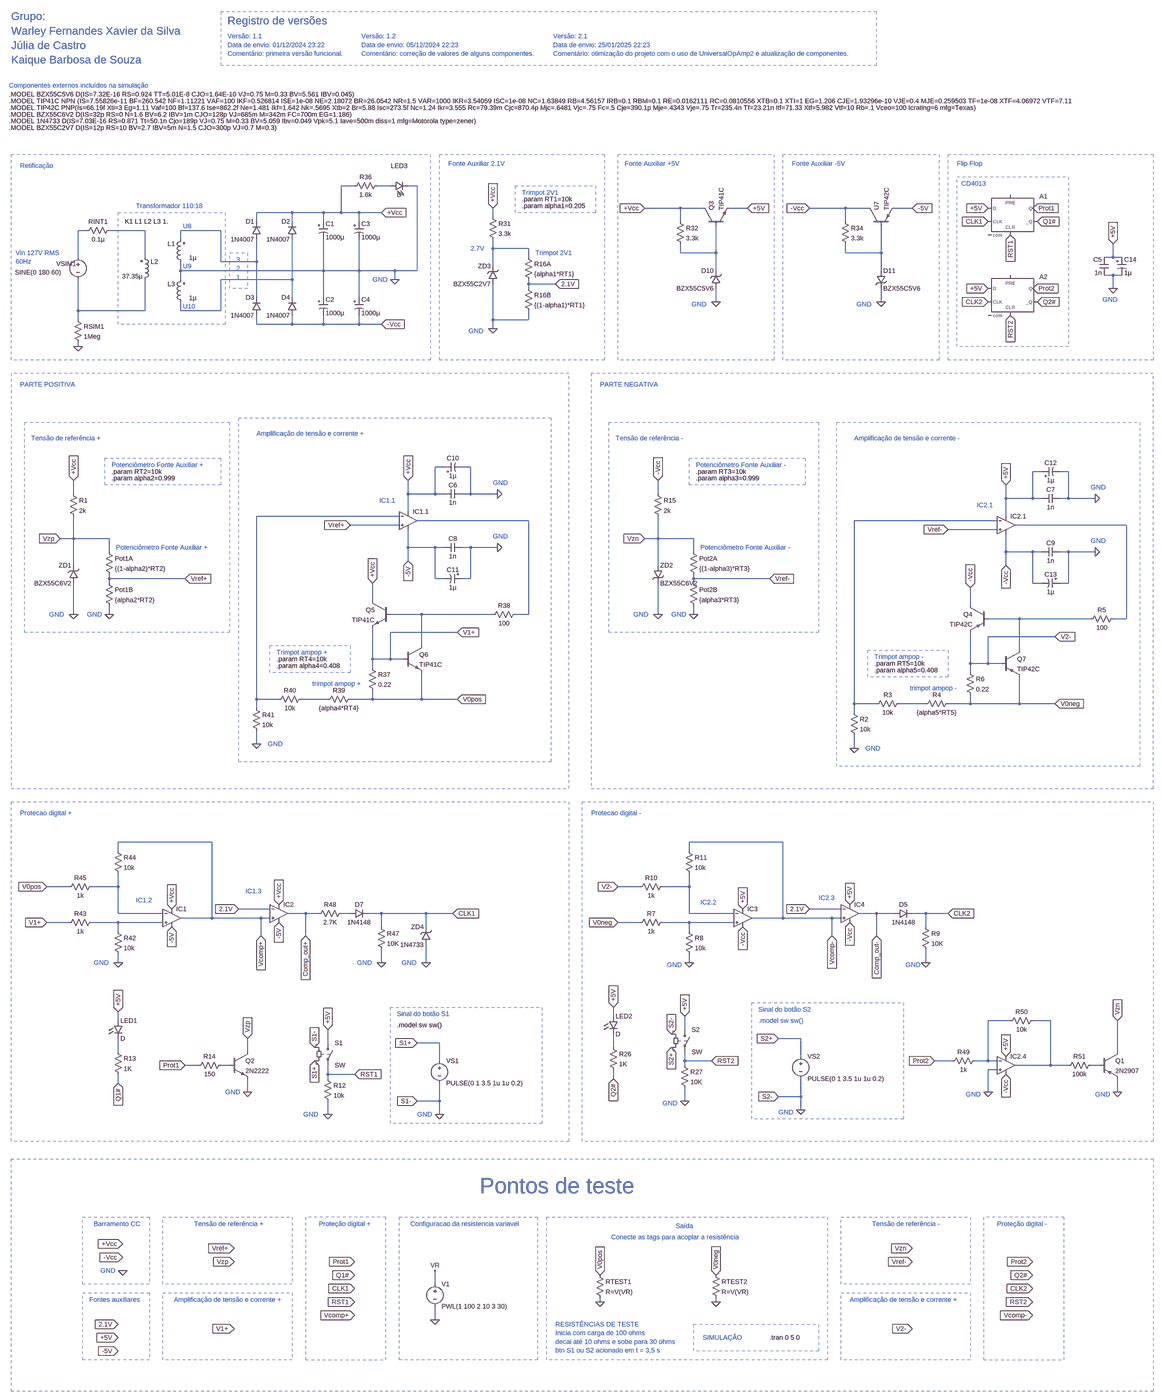
[diagram p0: schematic LinearVoltageSupply.asc, whole sheet]
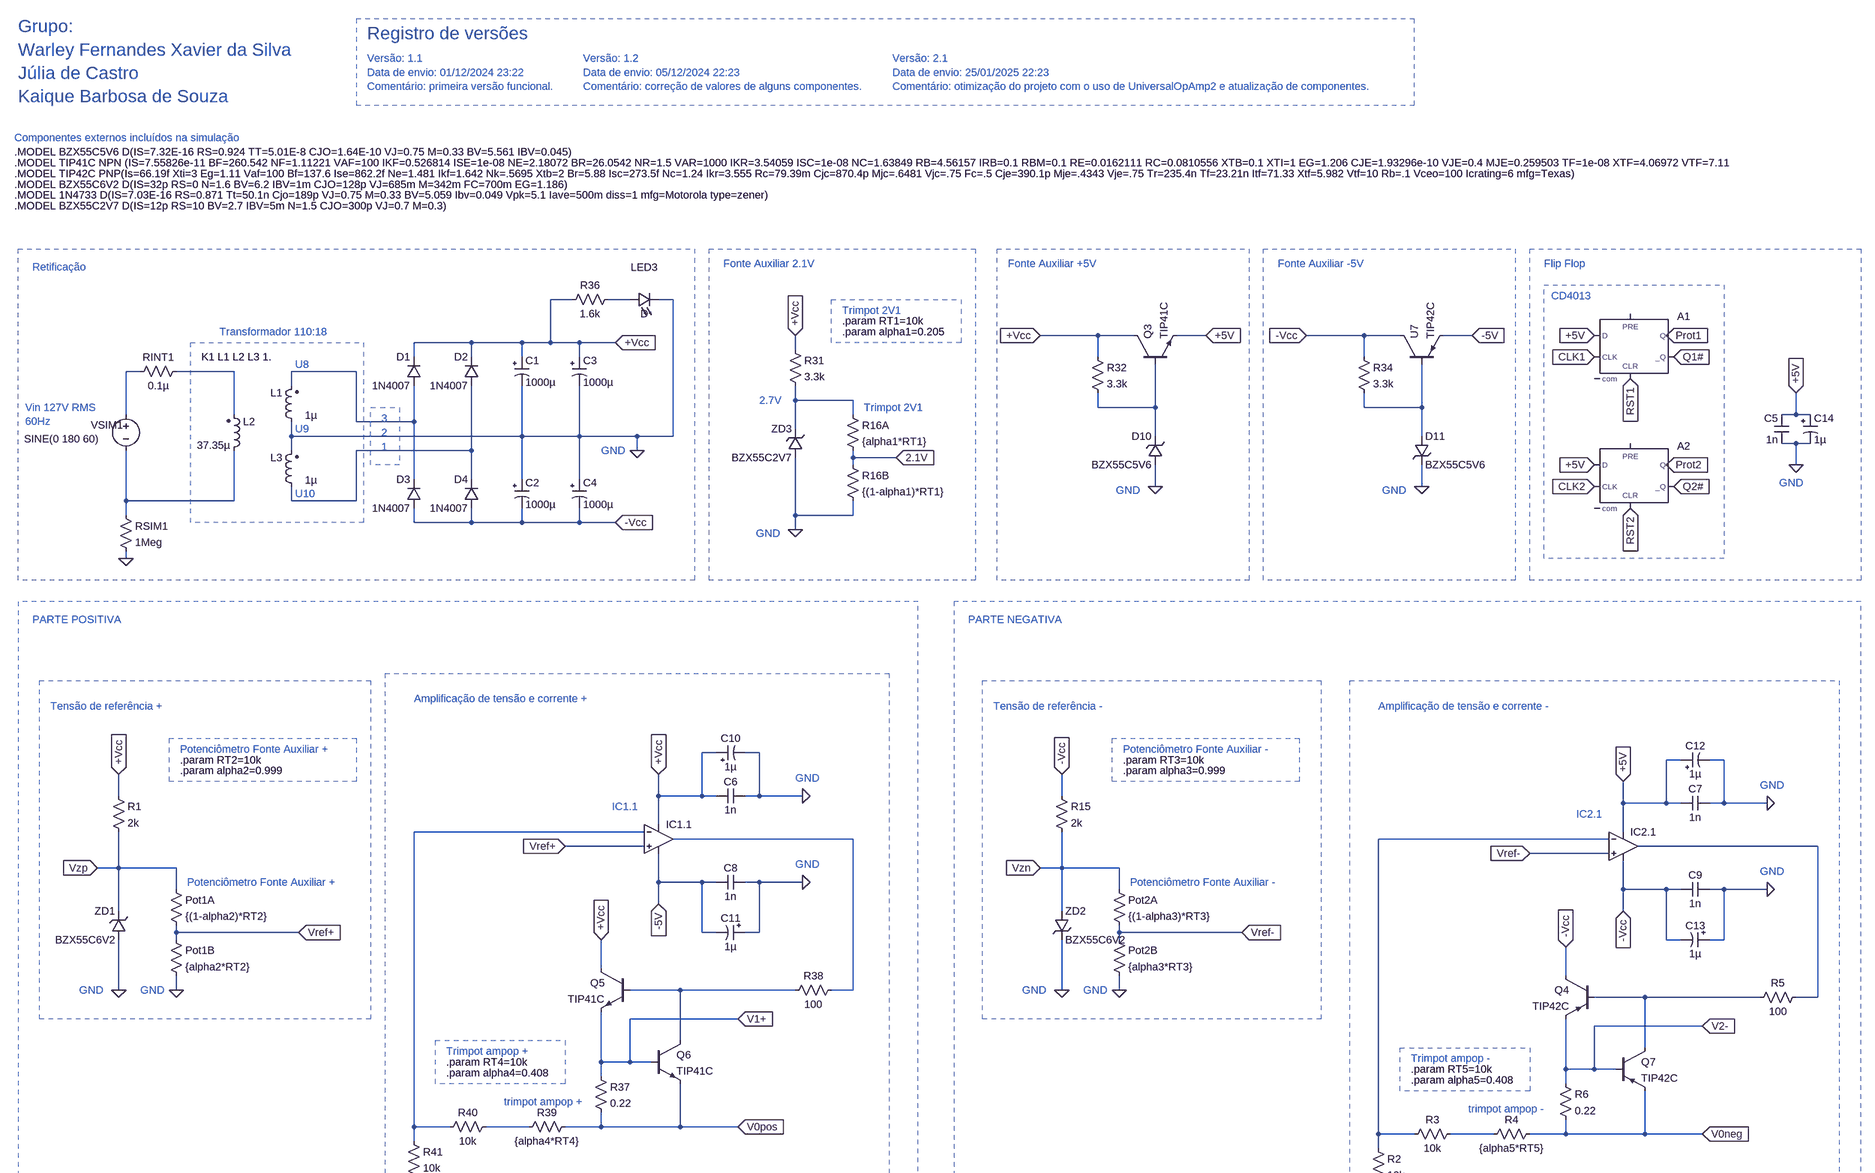
[diagram p1: schematic LinearVoltageSupply.asc, part, row 1 of 2, column 1 of 1]
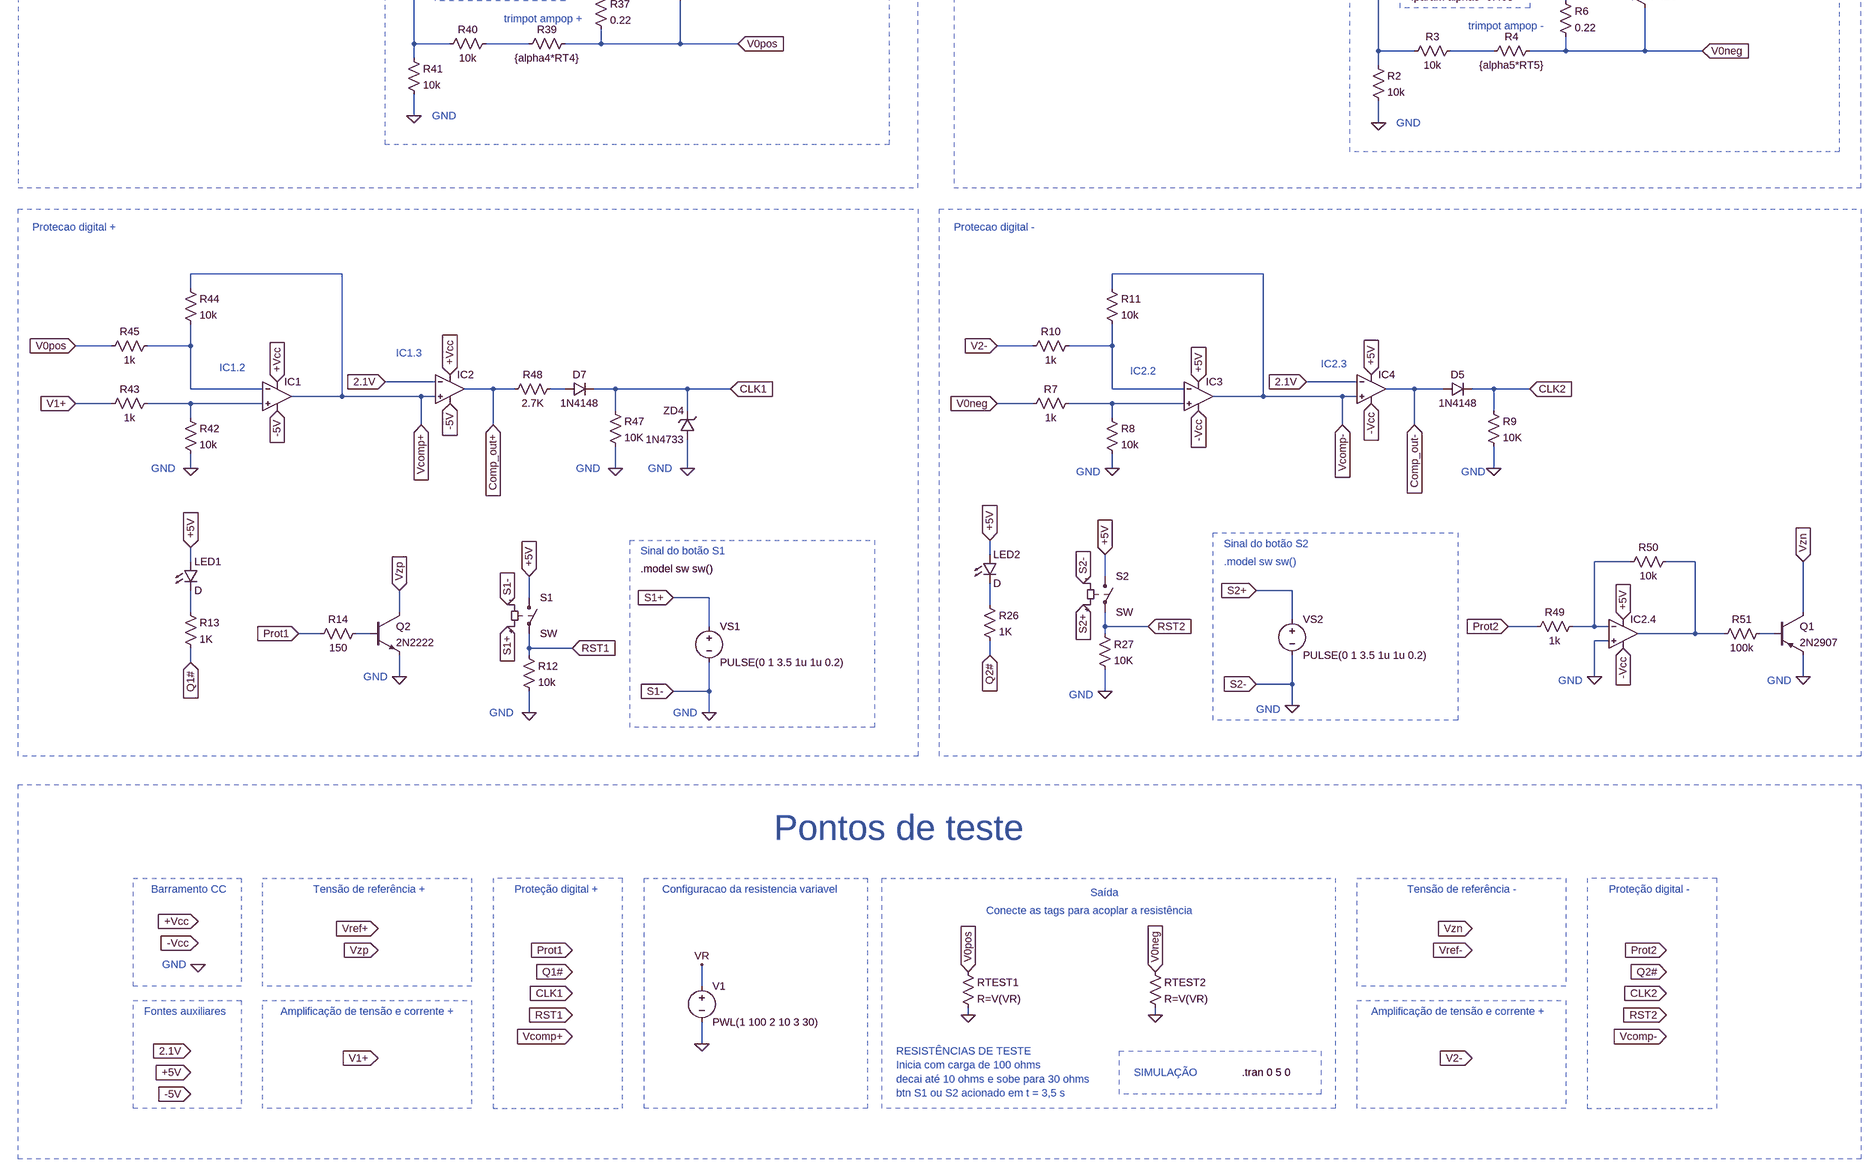
[diagram p2: schematic LinearVoltageSupply.asc, part, row 2 of 2, column 1 of 1]
LinearVoltageSupply.asc, the LTspice schematic file:
Version 4.1
SHEET 1 7264 6356
WIRE 1168 128 1120 128
WIRE 1296 128 1248 128
WIRE 1392 128 1360 128
WIRE 2336 208 2208 208
WIRE 2416 208 2336 208
WIRE 2576 208 2512 208
WIRE 2928 208 2800 208
WIRE 3008 208 2928 208
WIRE 3168 208 3104 208
WIRE 944 224 816 224
WIRE 1056 224 944 224
WIRE 1120 224 1120 128
WIRE 1120 224 1056 224
WIRE 1184 224 1120 224
WIRE 1264 224 1184 224
WIRE 1664 240 1664 208
WIRE 816 256 816 224
WIRE 944 256 944 224
WIRE 1056 256 1056 224
WIRE 1184 256 1184 224
WIRE 2336 256 2336 208
WIRE 2928 256 2928 208
WIRE 208 288 176 288
WIRE 416 288 288 288
WIRE 688 288 544 288
WIRE 544 320 544 288
WIRE 1664 352 1664 320
WIRE 1792 352 1664 352
WIRE 2336 368 2336 336
WIRE 2464 368 2464 272
WIRE 2464 368 2336 368
WIRE 2928 368 2928 336
WIRE 3056 368 3056 272
WIRE 3056 368 2928 368
WIRE 176 384 176 288
WIRE 416 384 416 288
WIRE 1792 384 1792 352
WIRE 3888 384 3888 336
WIRE 3888 384 3856 384
WIRE 3920 384 3888 384
WIRE 688 400 688 288
WIRE 816 400 816 320
WIRE 816 400 688 400
WIRE 1664 416 1664 352
WIRE 544 432 544 400
WIRE 1056 432 1056 320
WIRE 1056 432 544 432
WIRE 1184 432 1184 320
WIRE 1184 432 1056 432
WIRE 1312 432 1184 432
WIRE 1392 432 1392 128
WIRE 1392 432 1312 432
WIRE 2464 432 2464 368
WIRE 3056 432 3056 368
WIRE 3888 448 3856 448
WIRE 3920 448 3888 448
WIRE 544 464 544 432
WIRE 944 464 944 320
WIRE 944 464 688 464
WIRE 1312 464 1312 432
WIRE 1792 480 1792 464
WIRE 1888 480 1792 480
WIRE 1792 496 1792 480
WIRE 3888 496 3888 448
WIRE 816 528 816 400
WIRE 944 528 944 464
WIRE 1056 528 1056 432
WIRE 1184 528 1184 432
WIRE 2464 544 2464 496
WIRE 3056 544 3056 496
WIRE 176 576 176 464
WIRE 416 576 416 464
WIRE 416 576 176 576
WIRE 544 576 544 544
WIRE 688 576 688 464
WIRE 688 576 544 576
WIRE 176 608 176 576
WIRE 1664 608 1664 480
WIRE 1792 608 1792 576
WIRE 1792 608 1664 608
WIRE 816 624 816 592
WIRE 944 624 944 592
WIRE 944 624 816 624
WIRE 1056 624 1056 592
WIRE 1056 624 944 624
WIRE 1184 624 1184 592
WIRE 1184 624 1056 624
WIRE 1264 624 1184 624
WIRE 1664 640 1664 608
WIRE 176 704 176 688
WIRE 1488 1136 1456 1136
WIRE 1584 1136 1552 1136
WIRE 3632 1152 3600 1152
WIRE 3728 1152 3696 1152
WIRE 160 1232 160 1184
WIRE 1360 1232 1360 1184
WIRE 1456 1232 1456 1136
WIRE 1456 1232 1360 1232
WIRE 1488 1232 1456 1232
WIRE 1584 1232 1584 1136
WIRE 1584 1232 1552 1232
WIRE 1680 1232 1584 1232
WIRE 2256 1232 2256 1184
WIRE 3504 1248 3504 1200
WIRE 3600 1248 3600 1152
WIRE 3600 1248 3504 1248
WIRE 3632 1248 3600 1248
WIRE 3728 1248 3728 1152
WIRE 3728 1248 3696 1248
WIRE 3824 1248 3728 1248
WIRE 1360 1296 1360 1232
WIRE 1328 1312 816 1312
WIRE 3504 1312 3504 1248
WIRE 1792 1328 1392 1328
WIRE 3472 1328 2960 1328
WIRE 1328 1344 1152 1344
WIRE 3936 1344 3536 1344
WIRE 3472 1360 3296 1360
WIRE 160 1392 160 1312
WIRE 160 1392 112 1392
WIRE 288 1392 160 1392
WIRE 2256 1392 2256 1312
WIRE 2256 1392 2208 1392
WIRE 2384 1392 2256 1392
WIRE 1360 1424 1360 1360
WIRE 1456 1424 1360 1424
WIRE 1488 1424 1456 1424
WIRE 1584 1424 1552 1424
WIRE 1680 1424 1584 1424
WIRE 288 1440 288 1392
WIRE 2384 1440 2384 1392
WIRE 3504 1440 3504 1376
WIRE 3600 1440 3504 1440
WIRE 3632 1440 3600 1440
WIRE 3728 1440 3696 1440
WIRE 3824 1440 3728 1440
WIRE 1360 1472 1360 1424
WIRE 160 1488 160 1392
WIRE 2256 1488 2256 1392
WIRE 3504 1488 3504 1440
WIRE 288 1536 288 1520
WIRE 560 1536 288 1536
WIRE 1456 1536 1456 1424
WIRE 1488 1536 1456 1536
WIRE 1584 1536 1584 1424
WIRE 1584 1536 1552 1536
WIRE 2384 1536 2384 1520
WIRE 2656 1536 2384 1536
WIRE 288 1552 288 1536
WIRE 2384 1552 2384 1536
WIRE 3600 1552 3600 1440
WIRE 3632 1552 3600 1552
WIRE 3728 1552 3728 1440
WIRE 3728 1552 3696 1552
WIRE 1232 1616 1232 1552
WIRE 3376 1632 3376 1568
WIRE 160 1664 160 1552
WIRE 288 1664 288 1632
WIRE 1408 1664 1296 1664
WIRE 1664 1664 1408 1664
WIRE 1792 1664 1792 1328
WIRE 1792 1664 1744 1664
WIRE 2256 1664 2256 1552
WIRE 2384 1664 2384 1632
WIRE 3552 1680 3440 1680
WIRE 3808 1680 3552 1680
WIRE 3936 1680 3936 1344
WIRE 3936 1680 3888 1680
WIRE 1536 1728 1296 1728
WIRE 3680 1744 3440 1744
WIRE 1408 1776 1408 1664
WIRE 3552 1792 3552 1680
WIRE 1232 1824 1232 1712
WIRE 1296 1824 1296 1728
WIRE 1296 1824 1232 1824
WIRE 1344 1824 1296 1824
WIRE 3376 1840 3376 1728
WIRE 3440 1840 3440 1744
WIRE 3440 1840 3376 1840
WIRE 3488 1840 3440 1840
WIRE 1232 1856 1232 1824
WIRE 3376 1872 3376 1840
WIRE 816 1968 816 1312
WIRE 896 1968 816 1968
WIRE 1072 1968 976 1968
WIRE 1232 1968 1232 1936
WIRE 1232 1968 1152 1968
WIRE 1408 1968 1408 1872
WIRE 1408 1968 1232 1968
WIRE 1536 1968 1408 1968
WIRE 2960 1984 2960 1328
WIRE 3040 1984 2960 1984
WIRE 3216 1984 3120 1984
WIRE 3376 1984 3376 1952
WIRE 3376 1984 3296 1984
WIRE 3552 1984 3552 1888
WIRE 3552 1984 3376 1984
WIRE 3680 1984 3552 1984
WIRE 816 2000 816 1968
WIRE 2960 2016 2960 1984
WIRE 816 2128 816 2080
WIRE 2960 2144 2960 2096
WIRE 656 2480 320 2480
WIRE 2704 2480 2368 2480
WIRE 320 2512 320 2480
WIRE 2368 2512 2368 2480
WIRE 144 2640 64 2640
WIRE 320 2640 320 2592
WIRE 320 2640 224 2640
WIRE 2192 2640 2112 2640
WIRE 2368 2640 2368 2592
WIRE 2368 2640 2272 2640
WIRE 864 2720 752 2720
WIRE 2912 2720 2800 2720
WIRE 320 2736 320 2640
WIRE 480 2736 320 2736
WIRE 992 2736 928 2736
WIRE 1040 2736 992 2736
WIRE 1152 2736 1120 2736
WIRE 1264 2736 1216 2736
WIRE 1424 2736 1264 2736
WIRE 1520 2736 1424 2736
WIRE 2368 2736 2368 2640
WIRE 2528 2736 2368 2736
WIRE 3040 2736 2976 2736
WIRE 3104 2736 3040 2736
WIRE 3216 2736 3168 2736
WIRE 3296 2736 3216 2736
WIRE 656 2752 656 2480
WIRE 656 2752 544 2752
WIRE 832 2752 656 2752
WIRE 864 2752 832 2752
WIRE 2704 2752 2704 2480
WIRE 2704 2752 2592 2752
WIRE 2880 2752 2704 2752
WIRE 2912 2752 2880 2752
WIRE 144 2768 64 2768
WIRE 320 2768 224 2768
WIRE 480 2768 320 2768
WIRE 2192 2768 2112 2768
WIRE 2368 2768 2272 2768
WIRE 2528 2768 2368 2768
WIRE 1264 2784 1264 2736
WIRE 1424 2784 1424 2736
WIRE 3216 2784 3216 2736
WIRE 320 2800 320 2768
WIRE 2368 2800 2368 2768
WIRE 832 2816 832 2752
WIRE 992 2816 992 2736
WIRE 2880 2816 2880 2752
WIRE 3040 2816 3040 2736
WIRE 320 2912 320 2880
WIRE 1264 2912 1264 2864
WIRE 1424 2912 1424 2848
WIRE 2368 2912 2368 2880
WIRE 3216 2912 3216 2864
WIRE 2096 3104 2096 3072
WIRE 320 3120 320 3088
WIRE 3520 3120 3440 3120
WIRE 3664 3120 3600 3120
WIRE 2352 3152 2352 3104
WIRE 2768 3184 2688 3184
WIRE 1072 3200 1072 3152
WIRE 1472 3200 1392 3200
WIRE 2096 3216 2096 3168
WIRE 320 3232 320 3184
WIRE 784 3232 784 3184
WIRE 3904 3232 3904 3120
WIRE 2768 3248 2768 3184
WIRE 1472 3264 1472 3200
WIRE 2352 3264 2352 3232
WIRE 2448 3264 2352 3264
WIRE 3312 3264 3248 3264
WIRE 3440 3264 3440 3120
WIRE 3440 3264 3392 3264
WIRE 3472 3264 3440 3264
WIRE 608 3280 560 3280
WIRE 720 3280 688 3280
WIRE 2352 3280 2352 3264
WIRE 3664 3280 3664 3120
WIRE 3664 3280 3536 3280
WIRE 3728 3280 3664 3280
WIRE 3840 3280 3808 3280
WIRE 3472 3296 3440 3296
WIRE 1072 3312 1072 3280
WIRE 1168 3312 1072 3312
WIRE 1072 3328 1072 3312
WIRE 2096 3328 2096 3296
WIRE 320 3344 320 3312
WIRE 784 3376 784 3328
WIRE 3440 3376 3440 3296
WIRE 3904 3376 3904 3328
WIRE 2768 3392 2768 3328
WIRE 2768 3392 2688 3392
WIRE 1472 3408 1472 3344
WIRE 1472 3408 1392 3408
WIRE 2352 3408 2352 3360
WIRE 2768 3440 2768 3392
WIRE 1072 3456 1072 3408
WIRE 1472 3456 1472 3408
WIRE 1456 4064 1456 4016
WIRE 2048 4128 2048 4112
WIRE 2464 4128 2464 4112
WIRE 1456 4192 1456 4144
FLAG 2208 208 +Vcc
IOPIN 2208 208 In
FLAG 2464 544 0
FLAG 2576 208 +5V
IOPIN 2576 208 In
FLAG 2800 208 -Vcc
IOPIN 2800 208 In
FLAG 3056 544 0
FLAG 3168 208 -5V
IOPIN 3168 208 In
FLAG 336 3920 +Vcc
IOPIN 336 3920 In
FLAG 336 3968 -Vcc
IOPIN 336 3968 In
FLAG 336 4016 0
FLAG 320 4208 2.1V
IOPIN 320 4208 In
FLAG 320 4256 +5V
IOPIN 320 4256 In
FLAG 320 4304 -5V
IOPIN 320 4304 In
FLAG 736 3936 Vref+
IOPIN 736 3936 In
FLAG 736 3984 Vzp
IOPIN 736 3984 In
FLAG 736 4224 V1+
IOPIN 736 4224 In
FLAG 2048 4032 V0pos
IOPIN 2048 4032 In
FLAG 2464 4032 V0neg
IOPIN 2464 4032 In
FLAG 1168 3984 Prot1
IOPIN 1168 3984 In
FLAG 1168 4032 Q1#
IOPIN 1168 4032 In
FLAG 1168 4080 CLK1
IOPIN 1168 4080 In
FLAG 1168 4128 RST1
IOPIN 1168 4128 In
FLAG 1168 4176 Vcomp+
IOPIN 1168 4176 In
FLAG 3168 3936 Vzn
IOPIN 3168 3936 In
FLAG 3168 3984 Vref-
IOPIN 3168 3984 In
FLAG 3168 4224 V2-
IOPIN 3168 4224 In
FLAG 3600 3984 Prot2
IOPIN 3600 3984 In
FLAG 3600 4032 Q2#
IOPIN 3600 4032 In
FLAG 3600 4080 CLK2
IOPIN 3600 4080 In
FLAG 3600 4128 RST2
IOPIN 3600 4128 In
FLAG 3600 4176 Vcomp-
IOPIN 3600 4176 In
FLAG 176 704 0
FLAG 1264 224 +Vcc
IOPIN 1264 224 In
FLAG 1312 464 0
FLAG 1264 624 -Vcc
IOPIN 1264 624 In
FLAG 1888 480 2.1V
IOPIN 1888 480 In
FLAG 1664 208 +Vcc
IOPIN 1664 208 In
FLAG 1664 640 0
FLAG 3888 496 0
FLAG 3888 336 +5V
IOPIN 3888 336 In
FLAG 3440 256 CLK1
IOPIN 3440 256 In
FLAG 3440 208 +5V
IOPIN 3440 208 In
FLAG 3600 208 Prot1
IOPIN 3600 208 In
FLAG 3616 256 Q1#
IOPIN 3616 256 In
FLAG 3520 304 RST1
IOPIN 3520 304 In
FLAG 3440 544 CLK2
IOPIN 3440 544 In
FLAG 3440 496 +5V
IOPIN 3440 496 In
FLAG 3600 496 Prot2
IOPIN 3600 496 In
FLAG 3616 544 Q2#
IOPIN 3616 544 In
FLAG 3520 592 RST2
IOPIN 3520 592 In
FLAG 112 1392 Vzp
IOPIN 112 1392 In
FLAG 160 1664 0
FLAG 288 1664 0
FLAG 160 1184 +Vcc
IOPIN 160 1184 In
FLAG 560 1536 Vref+
IOPIN 560 1536 In
FLAG 2208 1392 Vzn
IOPIN 2208 1392 In
FLAG 2256 1664 0
FLAG 2384 1664 0
FLAG 2256 1184 -Vcc
IOPIN 2256 1184 In
FLAG 2656 1536 Vref-
IOPIN 2656 1536 In
FLAG 1360 1184 +Vcc
IOPIN 1360 1184 In
FLAG 1680 1232 0
FLAG 1360 1472 -5V
IOPIN 1360 1472 In
FLAG 1680 1424 0
FLAG 1152 1344 Vref+
IOPIN 1152 1344 In
FLAG 1232 1552 +Vcc
IOPIN 1232 1552 In
FLAG 1536 1728 V1+
IOPIN 1536 1728 In
FLAG 1536 1968 V0pos
IOPIN 1536 1968 In
FLAG 816 2128 0
FLAG 3504 1200 +5V
IOPIN 3504 1200 In
FLAG 3824 1248 0
FLAG 3504 1488 -Vcc
IOPIN 3504 1488 In
FLAG 3824 1440 0
FLAG 3296 1360 Vref-
IOPIN 3296 1360 In
FLAG 3376 1568 -Vcc
IOPIN 3376 1568 In
FLAG 3680 1744 V2-
IOPIN 3680 1744 In
FLAG 3680 1984 V0neg
IOPIN 3680 1984 In
FLAG 2960 2144 0
FLAG 64 2640 V0pos
IOPIN 64 2640 In
FLAG 64 2768 V1+
IOPIN 64 2768 In
FLAG 320 2912 0
FLAG 752 2720 2.1V
IOPIN 752 2720 In
FLAG 832 2816 Vcomp+
IOPIN 832 2816 In
FLAG 992 2816 Comp_out+
IOPIN 992 2816 In
FLAG 1264 2912 0
FLAG 1424 2912 0
FLAG 1520 2736 CLK1
IOPIN 1520 2736 In
FLAG 320 3344 Q1#
IOPIN 320 3344 In
FLAG 560 3280 Prot1
IOPIN 560 3280 In
FLAG 784 3184 Vzp
IOPIN 784 3184 In
FLAG 784 3376 0
FLAG 1392 3200 S1+
IOPIN 1392 3200 In
FLAG 1392 3408 S1-
IOPIN 1392 3408 In
FLAG 1024 3264 S1+
IOPIN 1024 3264 In
FLAG 1024 3216 S1-
IOPIN 1024 3216 In
FLAG 1472 3456 0
FLAG 1072 3152 +5V
IOPIN 1072 3152 In
FLAG 1072 3456 0
FLAG 1168 3312 RST1
IOPIN 1168 3312 In
FLAG 512 2784 -5V
IOPIN 512 2784 In
FLAG 512 2720 +Vcc
IOPIN 512 2720 In
FLAG 896 2704 +Vcc
IOPIN 896 2704 In
FLAG 896 2768 -5V
IOPIN 896 2768 In
FLAG 2112 2640 V2-
IOPIN 2112 2640 In
FLAG 2112 2768 V0neg
IOPIN 2112 2768 In
FLAG 2368 2912 0
FLAG 2800 2720 2.1V
IOPIN 2800 2720 In
FLAG 2880 2816 Vcomp-
IOPIN 2880 2816 In
FLAG 3040 2816 Comp_out-
IOPIN 3040 2816 In
FLAG 3216 2912 0
FLAG 3296 2736 CLK2
IOPIN 3296 2736 In
FLAG 2096 3072 +5V
IOPIN 2096 3072 In
FLAG 2096 3328 Q2#
IOPIN 2096 3328 In
FLAG 2688 3184 S2+
IOPIN 2688 3184 In
FLAG 2688 3392 S2-
IOPIN 2688 3392 In
FLAG 2304 3216 S2+
IOPIN 2304 3216 In
FLAG 2304 3168 S2-
IOPIN 2304 3168 In
FLAG 2768 3440 0
FLAG 2352 3104 +5V
IOPIN 2352 3104 In
FLAG 2352 3408 0
FLAG 2448 3264 RST2
IOPIN 2448 3264 In
FLAG 3248 3264 Prot2
IOPIN 3248 3264 In
FLAG 3440 3376 0
FLAG 3904 3376 0
FLAG 3904 3120 Vzn
IOPIN 3904 3120 In
FLAG 2560 2720 +5V
IOPIN 2560 2720 In
FLAG 2560 2784 -Vcc
IOPIN 2560 2784 In
FLAG 2944 2704 +5V
IOPIN 2944 2704 In
FLAG 2944 2768 -Vcc
IOPIN 2944 2768 In
FLAG 3504 3312 -Vcc
IOPIN 3504 3312 In
FLAG 3504 3248 +5V
IOPIN 3504 3248 In
FLAG 2048 4128 0
FLAG 2464 4128 0
FLAG 320 3088 +5V
IOPIN 320 3088 In
FLAG 1456 4192 0
FLAG 1456 4016 VR
SYMBOL res 2320 240 R0
SYMATTR InstName R32
SYMATTR Value 3.3k
SYMBOL npn 2416 272 R270
SYMATTR InstName Q3
SYMATTR Value TIP41C
SYMBOL zener 2480 496 R180
WINDOW 0 24 64 Left 2
WINDOW 3 24 0 Left 2
SYMATTR InstName D10
SYMATTR Value BZX55C5V6
SYMBOL res 2912 240 R0
SYMATTR InstName R34
SYMATTR Value 3.3k
SYMBOL zener 3040 432 R0
SYMATTR InstName D11
SYMATTR Value BZX55C5V6
SYMBOL pnp 3008 272 R270
SYMATTR InstName U7
SYMATTR Value TIP42C
SYMBOL voltage 176 368 R0
WINDOW 0 -78 39 Left 2
WINDOW 3 -226 70 Left 2
WINDOW 123 0 0 Left 0
WINDOW 39 0 0 Left 0
SYMATTR InstName VSIM1
SYMATTR Value SINE(0 180 60)
SYMBOL res 304 272 R90
WINDOW 0 0 56 VBottom 2
WINDOW 3 32 56 VTop 2
SYMATTR InstName RINT1
SYMATTR Value 0.1µ
SYMBOL res 160 592 R0
SYMATTR InstName RSIM1
SYMATTR Value 1Meg
SYMBOL ind2 560 416 R180
WINDOW 0 36 80 Left 2
WINDOW 3 -41 30 Left 2
SYMATTR InstName L1
SYMATTR Value 1µ
SYMBOL ind2 400 480 M180
WINDOW 0 36 80 Left 2
WINDOW 3 -66 28 Left 2
SYMATTR InstName L2
SYMATTR Value 37.35µ
SYMBOL diode 832 320 R180
WINDOW 0 24 64 Left 2
WINDOW 3 24 0 Left 2
SYMATTR InstName D1
SYMATTR Value 1N4007
SYMBOL diode 960 320 R180
WINDOW 0 24 64 Left 2
WINDOW 3 24 0 Left 2
SYMATTR InstName D2
SYMATTR Value 1N4007
SYMBOL diode 832 592 R180
WINDOW 0 24 64 Left 2
WINDOW 3 24 0 Left 2
SYMATTR InstName D3
SYMATTR Value 1N4007
SYMBOL diode 960 592 R180
WINDOW 0 24 64 Left 2
WINDOW 3 24 0 Left 2
SYMATTR InstName D4
SYMATTR Value 1N4007
SYMBOL polcap 1040 256 R0
SYMATTR InstName C1
SYMATTR Value 1000µ
SYMBOL polcap 1040 528 R0
SYMATTR InstName C2
SYMATTR Value 1000µ
SYMBOL polcap 1168 256 R0
SYMATTR InstName C3
SYMATTR Value 1000µ
SYMBOL polcap 1168 528 R0
SYMATTR InstName C4
SYMATTR Value 1000µ
SYMBOL res 1264 112 R90
WINDOW 0 0 56 VBottom 2
WINDOW 3 32 56 VTop 2
SYMATTR InstName R36
SYMATTR Value 1.6k
SYMBOL LED 1296 144 R270
WINDOW 0 72 32 VTop 2
WINDOW 3 0 32 VBottom 2
SYMATTR InstName LED3
SYMBOL ind2 560 560 R180
WINDOW 0 36 80 Left 2
WINDOW 3 -41 30 Left 2
SYMATTR InstName L3
SYMATTR Value 1µ
SYMBOL res 1648 224 R0
SYMATTR InstName R31
SYMATTR Value 3.3k
SYMBOL zener 1680 480 R180
WINDOW 0 24 64 Left 2
WINDOW 3 24 0 Left 2
SYMATTR InstName ZD3
SYMATTR Value BZX55C2V7
SYMBOL res 1776 368 R0
SYMATTR InstName R16A
SYMATTR Value {alpha1*RT1}
SYMBOL res 1776 480 R0
SYMATTR InstName R16B
SYMATTR Value {(1-alpha1)*RT1}
SYMBOL polcap 3904 384 R0
SYMATTR InstName C14
SYMATTR Value 1µ
SYMBOL cap 3872 448 R180
WINDOW 0 24 56 Left 2
WINDOW 3 24 8 Left 2
SYMATTR InstName C5
SYMATTR Value 1n
SYMBOL Digital\\dflop 3520 160 R0
SYMATTR InstName A1
SYMBOL Digital\\dflop 3520 448 R0
SYMATTR InstName A2
SYMBOL res 144 1216 R0
SYMATTR InstName R1
SYMATTR Value 2k
SYMBOL res 272 1424 R0
SYMATTR InstName Pot1A
SYMATTR Value {(1-alpha2)*RT2}
SYMBOL res 272 1536 R0
SYMATTR InstName Pot1B
SYMATTR Value {alpha2*RT2}
SYMBOL zener 176 1552 R180
WINDOW 0 24 64 Left 2
WINDOW 3 24 0 Left 2
SYMATTR InstName ZD1
SYMATTR Value BZX55C6V2
SYMBOL res 2240 1216 R0
SYMATTR InstName R15
SYMATTR Value 2k
SYMBOL res 2368 1424 R0
SYMATTR InstName Pot2A
SYMATTR Value {(1-alpha3)*RT3}
SYMBOL res 2368 1536 R0
SYMATTR InstName Pot2B
SYMATTR Value {alpha3*RT3}
SYMBOL zener 2240 1488 R0
SYMATTR InstName ZD2
SYMATTR Value BZX55C6V2
SYMBOL polcap 1488 1152 R270
WINDOW 0 32 32 VTop 2
WINDOW 3 0 32 VBottom 2
SYMATTR InstName C10
SYMATTR Value 1µ
SYMBOL cap 1552 1216 R90
WINDOW 0 0 32 VBottom 2
WINDOW 3 32 32 VTop 2
SYMATTR InstName C6
SYMATTR Value 1n
SYMBOL polcap 1552 1520 R90
WINDOW 0 0 32 VBottom 2
WINDOW 3 32 32 VTop 2
SYMATTR InstName C11
SYMATTR Value 1µ
SYMBOL cap 1552 1408 R90
WINDOW 0 0 32 VBottom 2
WINDOW 3 32 32 VTop 2
SYMATTR InstName C8
SYMATTR Value 1n
SYMBOL res 1760 1648 R90
WINDOW 0 0 56 VBottom 2
WINDOW 3 32 56 VTop 2
SYMATTR InstName R38
SYMATTR Value 100
SYMBOL npn 1296 1616 M0
SYMATTR InstName Q5
SYMATTR Value TIP41C
SYMBOL npn 1344 1776 R0
SYMATTR InstName Q6
SYMATTR Value TIP41C
SYMBOL res 1216 1840 R0
SYMATTR InstName R37
SYMATTR Value 0.22
SYMBOL res 800 1984 R0
SYMATTR InstName R41
SYMATTR Value 10k
SYMBOL res 992 1952 R90
WINDOW 0 0 56 VBottom 2
WINDOW 3 32 56 VTop 2
SYMATTR InstName R40
SYMATTR Value 10k
SYMBOL res 1168 1952 R90
WINDOW 0 0 56 VBottom 2
WINDOW 3 32 56 VTop 2
SYMATTR InstName R39
SYMATTR Value {alpha4*RT4}
SYMBOL polcap 3632 1168 R270
WINDOW 0 32 32 VTop 2
WINDOW 3 0 32 VBottom 2
SYMATTR InstName C12
SYMATTR Value 1µ
SYMBOL cap 3696 1232 R90
WINDOW 0 0 32 VBottom 2
WINDOW 3 32 32 VTop 2
SYMATTR InstName C7
SYMATTR Value 1n
SYMBOL polcap 3696 1536 R90
WINDOW 0 0 32 VBottom 2
WINDOW 3 32 32 VTop 2
SYMATTR InstName C13
SYMATTR Value 1µ
SYMBOL cap 3696 1424 R90
WINDOW 0 0 32 VBottom 2
WINDOW 3 32 32 VTop 2
SYMATTR InstName C9
SYMATTR Value 1n
SYMBOL res 3904 1664 R90
WINDOW 0 0 56 VBottom 2
WINDOW 3 32 56 VTop 2
SYMATTR InstName R5
SYMATTR Value 100
SYMBOL res 3360 1856 R0
SYMATTR InstName R6
SYMATTR Value 0.22
SYMBOL res 2944 2000 R0
SYMATTR InstName R2
SYMATTR Value 10k
SYMBOL res 3136 1968 R90
WINDOW 0 0 56 VBottom 2
WINDOW 3 32 56 VTop 2
SYMATTR InstName R3
SYMATTR Value 10k
SYMBOL res 3312 1968 R90
WINDOW 0 0 56 VBottom 2
WINDOW 3 32 56 VTop 2
SYMATTR InstName R4
SYMATTR Value {alpha5*RT5}
SYMBOL pnp 3440 1632 M0
SYMATTR InstName Q4
SYMATTR Value TIP42C
SYMBOL pnp 3488 1792 R0
SYMATTR InstName Q7
SYMATTR Value TIP42C
SYMBOL res 240 2624 R90
WINDOW 0 0 56 VBottom 2
WINDOW 3 32 56 VTop 2
SYMATTR InstName R45
SYMATTR Value 1k
SYMBOL res 304 2496 R0
SYMATTR InstName R44
SYMATTR Value 10k
SYMBOL res 128 2784 R270
WINDOW 0 32 56 VTop 2
WINDOW 3 0 56 VBottom 2
SYMATTR InstName R43
SYMATTR Value 1k
SYMBOL res 304 2784 R0
SYMATTR InstName R42
SYMATTR Value 10k
SYMBOL res 1136 2720 R90
WINDOW 0 0 56 VBottom 2
WINDOW 3 32 56 VTop 2
SYMATTR InstName R48
SYMATTR Value 2.7K
SYMBOL diode 1152 2752 R270
WINDOW 0 32 32 VTop 2
WINDOW 3 0 32 VBottom 2
SYMATTR InstName D7
SYMATTR Value 1N4148
SYMBOL zener 1440 2848 R180
WINDOW 0 24 64 Left 2
WINDOW 3 24 0 Left 2
SYMATTR InstName ZD4
SYMATTR Value 1N4733
SYMBOL res 1248 2768 R0
SYMATTR InstName R47
SYMATTR Value 10K
SYMBOL res 704 3264 R90
WINDOW 0 0 56 VBottom 2
WINDOW 3 32 56 VTop 2
SYMATTR InstName R14
SYMATTR Value 150
SYMBOL sw 1072 3184 R0
SYMATTR InstName S1
SYMBOL voltage 1472 3248 R0
WINDOW 123 0 0 Left 0
WINDOW 39 0 0 Left 0
SYMATTR InstName VS1
SYMATTR Value PULSE(0 1 3.5 1u 1u 0.2)
SYMBOL res 1056 3312 R0
SYMATTR InstName R12
SYMATTR Value 10k
SYMBOL res 2288 2624 R90
WINDOW 0 0 56 VBottom 2
WINDOW 3 32 56 VTop 2
SYMATTR InstName R10
SYMATTR Value 1k
SYMBOL res 2352 2496 R0
SYMATTR InstName R11
SYMATTR Value 10k
SYMBOL res 2176 2784 R270
WINDOW 0 32 56 VTop 2
WINDOW 3 0 56 VBottom 2
SYMATTR InstName R7
SYMATTR Value 1k
SYMBOL res 2352 2784 R0
SYMATTR InstName R8
SYMATTR Value 10k
SYMBOL diode 3104 2752 R270
WINDOW 0 32 32 VTop 2
WINDOW 3 0 32 VBottom 2
SYMATTR InstName D5
SYMATTR Value 1N4148
SYMBOL res 3200 2768 R0
SYMATTR InstName R9
SYMATTR Value 10K
SYMBOL LED 2080 3104 R0
SYMATTR InstName LED2
SYMBOL res 2080 3200 R0
SYMATTR InstName R26
SYMATTR Value 1K
SYMBOL sw 2352 3136 R0
SYMATTR InstName S2
SYMBOL voltage 2768 3232 R0
WINDOW 123 0 0 Left 0
WINDOW 39 0 0 Left 0
SYMATTR InstName VS2
SYMATTR Value PULSE(0 1 3.5 1u 1u 0.2)
SYMBOL res 2336 3264 R0
SYMATTR InstName R27
SYMATTR Value 10K
SYMBOL res 3408 3248 R90
WINDOW 0 0 56 VBottom 2
WINDOW 3 32 56 VTop 2
SYMATTR InstName R49
SYMATTR Value 1k
SYMBOL res 3616 3104 R90
WINDOW 0 0 56 VBottom 2
WINDOW 3 32 56 VTop 2
SYMATTR InstName R50
SYMATTR Value 10k
SYMBOL pnp 3840 3232 R0
SYMATTR InstName Q1
SYMATTR Value 2N2907
SYMBOL res 3824 3264 R90
WINDOW 0 0 56 VBottom 2
WINDOW 3 32 56 VTop 2
SYMATTR InstName R51
SYMATTR Value 100k
SYMBOL res 2032 4016 R0
SYMATTR InstName RTEST1
SYMATTR Value R=V(VR)
SYMBOL npn 720 3232 R0
SYMATTR InstName Q2
SYMATTR Value 2N2222
SYMBOL res 2448 4016 R0
SYMATTR InstName RTEST2
SYMATTR Value R=V(VR)
SYMBOL LED 304 3120 R0
SYMATTR InstName LED1
SYMBOL res 304 3216 R0
SYMATTR InstName R13
SYMATTR Value 1K
SYMBOL voltage 1456 4048 R0
WINDOW 123 0 0 Left 0
WINDOW 39 0 0 Left 0
SYMATTR InstName V1
SYMATTR Value PWL(1 100 2 10 3 30)
SYMBOL OpAmps\\UniversalOpAmp2 512 2752 R0
SYMATTR InstName IC1
SYMBOL OpAmps\\UniversalOpAmp2 896 2736 R0
SYMATTR InstName IC2
SYMBOL OpAmps\\UniversalOpAmp2 1360 1328 R0
SYMATTR InstName IC1.1
SYMBOL OpAmps\\UniversalOpAmp2 2560 2752 R0
SYMATTR InstName IC3
SYMBOL OpAmps\\UniversalOpAmp2 2944 2736 R0
SYMATTR InstName IC4
SYMBOL OpAmps\\UniversalOpAmp2 3504 1344 R0
SYMATTR InstName IC2.1
SYMBOL OpAmps\\UniversalOpAmp2 3504 3280 R0
SYMATTR InstName IC2.4
TEXT 2136 48 Left 2 ;Fonte Auxiliar +5V
TEXT 2376 552 Left 2 ;GND
TEXT 2736 48 Left 2 ;Fonte Auxiliar -5V
TEXT 2968 552 Left 2 ;GND
TEXT 3328 48 Left 2 ;Flip Flop
TEXT -72 -232 Left 2 ;Componentes externos incluídos na simulação
TEXT -32 840 Left 2 ;PARTE POSITIVA
TEXT 2048 840 Left 2 ;PARTE NEGATIVA
TEXT 256 4016 Left 2 ;GND
TEXT 232 3848 Left 2 ;Barramento CC
TEXT 216 4120 Left 2 ;Fontes auxiliares
TEXT 592 3848 Left 2 ;Tensão de referência +
TEXT 520 4120 Left 2 ;Amplificação de tensão e corrente +
TEXT 2320 3856 Left 2 ;Saída
TEXT 1040 3848 Left 2 ;Proteção digital +
TEXT 3024 3848 Left 2 ;Tensão de referência -
TEXT 2944 4120 Left 2 ;Amplificação de tensão e corrente +
TEXT 3472 3848 Left 2 ;Proteção digital -
TEXT 1616 3712 Left 6 ;Pontos de teste
TEXT 344 256 Left 2 !K1 L1 L2 L3 1.
TEXT -32 56 Left 2 ;Retificação
TEXT 1232 464 Left 2 ;GND
TEXT 552 272 Left 2 ;U8
TEXT 552 416 Left 2 ;U9
TEXT 552 560 Left 2 ;U10
TEXT 744 392 Left 2 ;3
TEXT 744 424 Left 2 ;2
TEXT 744 456 Left 2 ;1
TEXT 384 200 Left 2 ;Transformador 110:18
TEXT -48 368 Left 2 ;Vin 127V RMS\n60Hz
TEXT 1504 48 Left 2 ;Fonte Auxiliar 2.1V
TEXT 1584 352 Left 2 ;2.7V
TEXT 1816 368 Left 2 ;Trimpot 2V1
TEXT 1768 176 Left 2 !.param RT1=10k
TEXT 1768 200 Left 2 !.param alpha1=0.205
TEXT 1768 152 Left 2 ;Trimpot 2V1
TEXT 1576 648 Left 2 ;GND
TEXT 3904 536 Right 2 ;GND
TEXT 3344 120 Left 2 ;CD4013
TEXT 8 1032 Left 2 ;Tensão de referência +
TEXT 72 1664 Left 2 ;GND
TEXT 208 1664 Left 2 ;GND
TEXT 296 1152 Left 2 !.param RT2=10k
TEXT 296 1176 Left 2 !.param alpha2=0.999
TEXT 296 1128 Left 2 ;Potenciômetro Fonte Auxiliar +
TEXT 312 1424 Left 2 ;Potenciômetro Fonte Auxiliar +
TEXT 2104 1032 Left 2 ;Tensão de referência -
TEXT 2168 1664 Left 2 ;GND
TEXT 2304 1664 Left 2 ;GND
TEXT 2392 1152 Left 2 !.param RT3=10k
TEXT 2392 1176 Left 2 !.param alpha3=0.999
TEXT 2392 1128 Left 2 ;Potenciômetro Fonte Auxiliar -
TEXT 2408 1424 Left 2 ;Potenciômetro Fonte Auxiliar -
TEXT 816 1016 Left 2 ;Amplificação de tensão e corrente +
TEXT 1256 1256 Left 2 ;IC1.1
TEXT 1664 1192 Left 2 ;GND
TEXT 1664 1384 Left 2 ;GND
TEXT 856 2128 Left 2 ;GND
TEXT 888 1824 Left 2 !.param RT4=10k
TEXT 888 1848 Left 2 !.param alpha4=0.408
TEXT 888 1800 Left 2 ;Trimpot ampop +
TEXT 1016 1912 Left 2 ;trimpot ampop +
TEXT 2960 1032 Left 2 ;Amplificação de tensão e corrente -
TEXT 3400 1272 Left 2 ;IC2.1
TEXT 3808 1208 Left 2 ;GND
TEXT 3808 1400 Left 2 ;GND
TEXT 3000 2144 Left 2 ;GND
TEXT 3032 1840 Left 2 !.param RT5=10k
TEXT 3032 1864 Left 2 !.param alpha5=0.408
TEXT 3032 1816 Left 2 ;Trimpot ampop -
TEXT 3160 1928 Left 2 ;trimpot ampop -
TEXT -32 2376 Left 2 ;Protecao digital +
TEXT 776 2656 Left 2 ;IC1.3
TEXT 384 2688 Left 2 ;IC1.2
TEXT 1320 3136 Left 2 !.model sw sw()
TEXT 1320 3096 Left 2 ;Sinal do botão S1
TEXT 232 2912 Left 2 ;GND
TEXT 1176 2912 Left 2 ;GND
TEXT 1336 2912 Left 2 ;GND
TEXT 1392 3456 Left 2 ;GND
TEXT 984 3456 Left 2 ;GND
TEXT 704 3376 Left 2 ;GND
TEXT 2016 2376 Left 2 ;Protecao digital -
TEXT 2832 2680 Left 2 ;IC2.3
TEXT 2408 2696 Left 2 ;IC2.2
TEXT 2616 3120 Left 2 ;.model sw sw()
TEXT 2616 3080 Left 2 ;Sinal do botão S2
TEXT 3144 2920 Left 2 ;GND
TEXT 2288 2920 Left 2 ;GND
TEXT 2272 3416 Left 2 ;GND
TEXT 2688 3448 Left 2 ;GND
TEXT 3360 3384 Left 2 ;GND
TEXT 3824 3384 Left 2 ;GND
TEXT -72 -200 Left 2 !.MODEL BZX55C5V6 D(IS=7.32E-16 RS=0.924 TT=5.01E-8 CJO=1.64E-10 VJ=0.75 M=0.33 BV=5.561 IBV=0.045)
TEXT -72 -176 Left 2 !.MODEL TIP41C NPN (IS=7.55826e-11 BF=260.542 NF=1.11221 VAF=100 IKF=0.526814 ISE=1e-08 NE=2.18072 BR=26.0542 NR=1.5 VAR=1000 IKR=3.54059 ISC=1e-08 NC=1.63849 RB=4.56157 IRB=0.1 RBM=0.1 RE=0.0162111 RC=0.0810556 XTB=0.1 XTI=1 EG=1.206 CJE=1.93296e-10 VJE=0.4 MJE=0.259503 TF=1e-08 XTF=4.06972 VTF=7.1157 ITF=0.001 CJC=1.09657e-10 VJC=0.730921 MJC=0.23 XCJC=0.803085 FC=0.8 TR=9.01013e-08 PTF=0 Vceo=100 ICrating=6 mfg=ON_Semi)
TEXT -72 -152 Left 2 !.MODEL TIP42C PNP(Is=66.19f Xti=3 Eg=1.11 Vaf=100 Bf=137.6 Ise=862.2f Ne=1.481 Ikf=1.642 Nk=.5695 Xtb=2 Br=5.88 Isc=273.5f Nc=1.24 Ikr=3.555 Rc=79.39m Cjc=870.4p Mjc=.6481 Vjc=.75 Fc=.5 Cje=390.1p Mje=.4343 Vje=.75 Tr=235.4n Tf=23.21n Itf=71.33 Xtf=5.982 Vtf=10 Rb=.1 Vceo=100 Icrating=6 mfg=Texas)
TEXT -72 -128 Left 2 !.MODEL BZX55C6V2 D(IS=32p RS=0 N=1.6 BV=6.2 IBV=1m CJO=128p VJ=685m M=342m FC=700m EG=1.186)
TEXT -72 -104 Left 2 !.MODEL 1N4733 D(IS=7.03E-16 RS=0.871 Tt=50.1n Cjo=189p VJ=0.75 M=0.33 BV=5.059 Ibv=0.049 Vpk=5.1 Iave=500m diss=1 mfg=Motorola type=zener)
TEXT 2656 4256 Left 2 !.tran 0 5 0
TEXT -64 -480 Left 4 ;Grupo: \nWarley Fernandes Xavier da Silva\nJúlia de Castro\nKaique Barbosa de Souza
TEXT 2088 3896 Left 2 ;Conecte as tags para acoplar a resistência
TEXT 2416 4256 Left 2 ;SIMULAÇÃO
TEXT -72 -80 Left 2 !.MODEL BZX55C2V7 D(IS=12p RS=10 BV=2.7 IBV=5m N=1.5 CJO=300p VJ=0.7 M=0.3)
TEXT 1368 3848 Left 2 ;Configuracao da resistencia variavel
TEXT 712 -408 Left 2 ;Versão: 1.1\nData de envio: 01/12/2024 23:22\nComentário: primeira versão funcional.
TEXT 1192 -408 Left 2 ;Versão: 1.2\nData de envio: 05/12/2024 22:23\nComentário: correção de valores de alguns componentes.
TEXT 1880 -408 Left 2 ;Versão: 2.1\nData de envio: 25/01/2025 22:23\nComentário: otimização do projeto com o uso de UniversalOpAmp2 e atualização de componentes.
TEXT 712 -464 Left 4 ;Registro de versões
TEXT 1888 4208 Left 2 ;RESISTÊNCIAS DE TESTE\nInicia com carga de 100 ohms\ndecai até 10 ohms e sobe para 30 ohms\nbtn S1 ou S2 acionado em t = 3,5 s
RECTANGLE Normal 2672 752 2112 16 2
RECTANGLE Normal 3264 752 2704 16 2
RECTANGLE Normal 4032 752 3296 16 2
RECTANGLE Normal 1936 800 -64 2288 2
RECTANGLE Normal 4032 800 2016 2288 2
RECTANGLE Normal 432 4064 192 3824 2
RECTANGLE Normal 432 4336 192 4096 2
RECTANGLE Normal 944 4336 480 4096 2
RECTANGLE Normal 944 4064 480 3824 2
RECTANGLE Normal 2864 4336 1856 3824 2
RECTANGLE Normal 992 4336 1280 3824 2
RECTANGLE Normal 3376 4336 2912 4096 2
RECTANGLE Normal 3376 4064 2912 3824 2
RECTANGLE Normal 3424 4336 3712 3824 2
RECTANGLE Normal 4032 4448 -64 3616 2
RECTANGLE Normal 1440 752 -64 16 2
RECTANGLE Normal 784 496 720 368 1
RECTANGLE Normal 704 624 320 224 1
RECTANGLE Normal 2064 752 1472 16 2
RECTANGLE Normal 2032 224 1744 128 1
RECTANGLE Normal 3728 704 3328 96 1
RECTANGLE Normal 720 1728 -16 976 2
RECTANGLE Normal 688 1200 272 1104 1
RECTANGLE Normal 2832 1728 2080 976 2
RECTANGLE Normal 2784 1200 2368 1104 1
RECTANGLE Normal 1872 2192 752 960 2
RECTANGLE Normal 1152 1872 864 1776 1
RECTANGLE Normal 3984 2208 2896 976 2
RECTANGLE Normal 3296 1888 3008 1792 1
RECTANGLE Normal 1840 3488 1296 3072 1
RECTANGLE Normal 1936 3552 -64 2336 2
RECTANGLE Normal 3136 3472 2592 3056 2
RECTANGLE Normal 4032 3552 1984 2336 2
RECTANGLE Normal 2832 4304 2384 4208 1
RECTANGLE Normal 1824 4336 1328 3824 2
RECTANGLE Normal 3040 -496 688 -304 2

The netlist it stands for:
* LinearVoltageSupply.asc
R32 +Vcc N006 3.3k
Q3 +Vcc N006 +5V 0 TIP41C
D10 0 N006 BZX55C5V6
R34 -Vcc N007 3.3k
D11 N007 0 BZX55C5V6
Q§U7 -Vcc N007 -5V 0 TIP42C
VSIM1 N002 N009 SINE(0 180 60)
RINT1 N003 N002 0.1µ
RSIM1 N009 0 1Meg
L1 0 N004 1µ
L2 N009 N003 37.35µ
D1 N004 +Vcc 1N4007
D2 N008 +Vcc 1N4007
D3 -Vcc N004 1N4007
D4 -Vcc N008 1N4007
C1 +Vcc 0 1000µ
C2 0 -Vcc 1000µ
C3 +Vcc 0 1000µ
C4 0 -Vcc 1000µ
R36 N001 +Vcc 1.6k
D§LED3 N001 0 D
L3 N008 0 1µ
R31 +Vcc N005 3.3k
D§ZD3 0 N005 BZX55C2V7
R16A N005 2.1V {alpha1*RT1}
R16B 2.1V 0 {(1-alpha1)*RT1}
C14 +5V 0 1µ
C5 0 +5V 1n
A1 +5V 0 CLK1 0 RST1 Q1# Prot1 0 DFLOP
A2 +5V 0 CLK2 0 RST2 Q2# Prot2 0 DFLOP
R1 +Vcc Vzp 2k
R§Pot1A Vzp Vref+ {(1-alpha2)*RT2}
R§Pot1B Vref+ 0 {alpha2*RT2}
D§ZD1 0 Vzp BZX55C6V2
R15 -Vcc Vzn 2k
R§Pot2A Vzn Vref- {(1-alpha3)*RT3}
R§Pot2B Vref- 0 {alpha3*RT3}
D§ZD2 Vzn 0 BZX55C6V2
C10 +Vcc 0 1µ
C6 0 +Vcc 1n
C11 0 -5V 1µ
C8 0 -5V 1n
R38 N011 N014 100
Q5 +Vcc N014 V1+ 0 TIP41C
Q6 N014 V1+ V0pos 0 TIP41C
R37 V1+ V0pos 0.22
R41 N010 0 10k
R40 N016 N010 10k
R39 V0pos N016 {alpha4*RT4}
C12 +5V 0 1µ
C7 0 +5V 1n
C13 0 -Vcc 1µ
C9 0 -Vcc 1n
R5 N013 N015 100
R6 V2- V0neg 0.22
R2 N012 0 10k
R3 N017 N012 10k
R4 V0neg N017 {alpha5*RT5}
Q4 -Vcc N015 V2- 0 TIP42C
Q7 N015 V2- V0neg 0 TIP42C
R45 N018 V0pos 1k
R44 Vcomp+ N018 10k
R43 V1+ N021 1k
R42 N021 0 10k
R48 N020 Comp_out+ 2.7K
D7 N020 CLK1 1N4148
D§ZD4 0 CLK1 1N4733
R47 CLK1 0 10K
R14 N027 Prot1 150
S1 +5V RST1 S1+ 0 SW
VS1 S1+ 0 PULSE(0 1 3.5 1u 1u 0.2)
R12 RST1 0 10k
R10 N019 V2- 1k
R11 Vcomp- N019 10k
R7 V0neg N022 1k
R8 N022 0 10k
D5 Comp_out- CLK2 1N4148
R9 CLK2 0 10K
D§LED2 +5V N025 D
R26 N025 Q2# 1K
S2 +5V RST2 S2+ 0 SW
VS2 S2+ 0 PULSE(0 1 3.5 1u 1u 0.2)
R27 RST2 0 10K
R49 N023 Prot2 1k
R50 N024 N023 10k
Q1 Vzn N028 0 0 2N2907
R51 N028 N024 100k
RTEST1 V0pos 0 R=V(VR)
Q2 Vzp N027 0 0 2N2222
RTEST2 V0neg 0 R=V(VR)
D§LED1 +5V N026 D
R13 N026 Q1# 1K
V1 VR 0 PWL(1 100 2 10 3 30)
X§IC1 N021 N018 +Vcc -5V Vcomp+ level2 Avol=1Meg GBW=10Meg Slew=10Meg Ilimit=25m Rail=0 Vos=0 En=0 Enk=0 In=0 Ink=0 Rin=500Meg  ; pins In+ In- V+ V- OUT
X§IC2 Vcomp+ 2.1V +Vcc -5V Comp_out+ level2 Avol=1Meg GBW=10Meg Slew=10Meg Ilimit=25m Rail=0 Vos=0 En=0 Enk=0 In=0 Ink=0 Rin=500Meg  ; pins In+ In- V+ V- OUT
X§IC1.1 Vref+ N010 +Vcc -5V N011 level2 Avol=1Meg GBW=10Meg Slew=10Meg Ilimit=25m Rail=0 Vos=0 En=0 Enk=0 In=0 Ink=0 Rin=500Meg  ; pins In+ In- V+ V- OUT
X§IC3 N022 N019 +5V -Vcc Vcomp- level2 Avol=1Meg GBW=10Meg Slew=10Meg Ilimit=25m Rail=0 Vos=0 En=0 Enk=0 In=0 Ink=0 Rin=500Meg  ; pins In+ In- V+ V- OUT
X§IC4 Vcomp- 2.1V +5V -Vcc Comp_out- level2 Avol=1Meg GBW=10Meg Slew=10Meg Ilimit=25m Rail=0 Vos=0 En=0 Enk=0 In=0 Ink=0 Rin=500Meg  ; pins In+ In- V+ V- OUT
X§IC2.1 Vref- N012 +5V -Vcc N013 level2 Avol=1Meg GBW=10Meg Slew=10Meg Ilimit=25m Rail=0 Vos=0 En=0 Enk=0 In=0 Ink=0 Rin=500Meg  ; pins In+ In- V+ V- OUT
X§IC2.4 0 N023 +5V -Vcc N024 level2 Avol=1Meg GBW=10Meg Slew=10Meg Ilimit=25m Rail=0 Vos=0 En=0 Enk=0 In=0 Ink=0 Rin=500Meg  ; pins In+ In- V+ V- OUT
.model D D
.lib standard.dio
.model NPN NPN
.model PNP PNP
.lib standard.bjt
* Fonte Auxiliar +5V
* GND
* Fonte Auxiliar -5V
* GND
* Flip Flop
* Componentes externos incluídos na simulação
* PARTE POSITIVA
* PARTE NEGATIVA
* GND
* Barramento CC
* Fontes auxiliares
* Tensão de referência +
* Amplificação de tensão e corrente +
* Saída
* Proteção digital +
* Tensão de referência -
* Amplificação de tensão e corrente +
* Proteção digital -
* Pontos de teste
K1 L1 L2 L3 1.
* Retificação
* GND
* U8
* U9
* U10
* 3
* 2
* 1
* Transformador 110:18
* Vin 127V RMS
* 60Hz
* Fonte Auxiliar 2.1V
* 2.7V
* Trimpot 2V1
.param RT1=10k
.param alpha1=0.205
* Trimpot 2V1
* GND
* GND
* CD4013
* Tensão de referência +
* GND
* GND
.param RT2=10k
.param alpha2=0.999
* Potenciômetro Fonte Auxiliar +
* Potenciômetro Fonte Auxiliar +
* Tensão de referência -
* GND
* GND
.param RT3=10k
.param alpha3=0.999
* Potenciômetro Fonte Auxiliar -
* Potenciômetro Fonte Auxiliar -
* Amplificação de tensão e corrente +
* IC1.1
* GND
* GND
* GND
.param RT4=10k
.param alpha4=0.408
* Trimpot ampop +
* trimpot ampop +
* Amplificação de tensão e corrente -
* IC2.1
* GND
* GND
* GND
.param RT5=10k
.param alpha5=0.408
* Trimpot ampop -
* trimpot ampop -
* Protecao digital +
* IC1.3
* IC1.2
.model sw sw()
* Sinal do botão S1
* GND
* GND
* GND
* GND
* GND
* GND
* Protecao digital -
* IC2.3
* IC2.2
* .model sw sw()
* Sinal do botão S2
* GND
* GND
* GND
* GND
* GND
* GND
.MODEL BZX55C5V6 D(IS=7.32E-16 RS=0.924 TT=5.01E-8 CJO=1.64E-10 VJ=0.75 M=0.33 BV=5.561 IBV=0.045)
.MODEL TIP41C NPN (IS=7.55826e-11 BF=260.542 NF=1.11221 VAF=100 IKF=0.526814 ISE=1e-08 NE=2.18072 BR=26.0542 NR=1.5 VAR=1000 IKR=3.54059 ISC=1e-08 NC=1.63849 RB=4.56157 IRB=0.1 RBM=0.1 RE=0.0162111 RC=0.0810556 XTB=0.1 XTI=1 EG=1.206 CJE=1.93296e-10 VJE=0.4 MJE=0.259503 TF=1e-08 XTF=4.06972 VTF=7.1157 ITF=0.001 CJC=1.09657e-10 VJC=0.730921 MJC=0.23 XCJC=0.803085 FC=0.8 TR=9.01013e-08 PTF=0 Vceo=100 ICrating=6 mfg=ON_Semi)
.MODEL TIP42C PNP(Is=66.19f Xti=3 Eg=1.11 Vaf=100 Bf=137.6 Ise=862.2f Ne=1.481 Ikf=1.642 Nk=.5695 Xtb=2 Br=5.88 Isc=273.5f Nc=1.24 Ikr=3.555 Rc=79.39m Cjc=870.4p Mjc=.6481 Vjc=.75 Fc=.5 Cje=390.1p Mje=.4343 Vje=.75 Tr=235.4n Tf=23.21n Itf=71.33 Xtf=5.982 Vtf=10 Rb=.1 Vceo=100 Icrating=6 mfg=Texas)
.MODEL BZX55C6V2 D(IS=32p RS=0 N=1.6 BV=6.2 IBV=1m CJO=128p VJ=685m M=342m FC=700m EG=1.186)
.MODEL 1N4733 D(IS=7.03E-16 RS=0.871 Tt=50.1n Cjo=189p VJ=0.75 M=0.33 BV=5.059 Ibv=0.049 Vpk=5.1 Iave=500m diss=1 mfg=Motorola type=zener)
.tran 0 5 0
* Grupo:
* Warley Fernandes Xavier da Silva
* Júlia de Castro
* Kaique Barbosa de Souza
* Conecte as tags para acoplar a resistência
* SIMULAÇÃO
.MODEL BZX55C2V7 D(IS=12p RS=10 BV=2.7 IBV=5m N=1.5 CJO=300p VJ=0.7 M=0.3)
* Configuracao da resistencia variavel
* Versão: 1.1
* Data de envio: 01/12/2024 23:22
* Comentário: primeira versão funcional.
* Versão: 1.2
* Data de envio: 05/12/2024 22:23
* Comentário: correção de valores de alguns componentes.
* Versão: 2.1
* Data de envio: 25/01/2025 22:23
* Comentário: otimização do projeto com o uso de UniversalOpAmp2 e atualização de componentes.
* Registro de versões
* RESISTÊNCIAS DE TESTE
* Inicia com carga de 100 ohms
* decai até 10 ohms e sobe para 30 ohms
* btn S1 ou S2 acionado em t = 3,5 s
.lib UniversalOpAmp2.lib
.backanno
.end